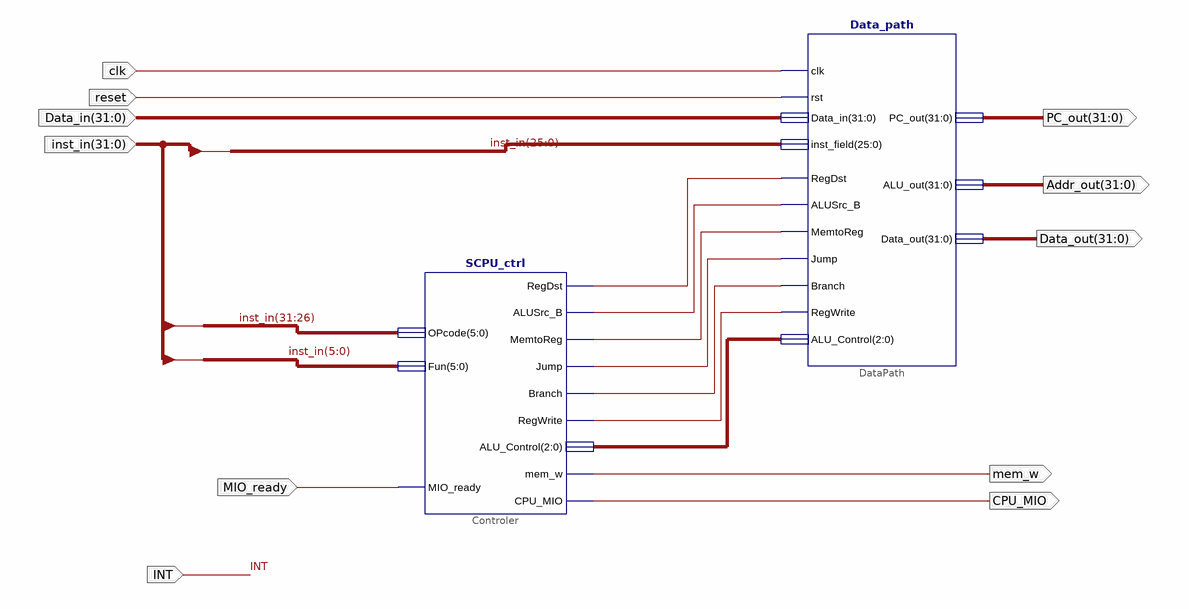
[diagram p0: schematic sheet 1]
// Xilinx ISE schematic SCPU.sch (kintex7) as structural Verilog: 2 symbols, 11 ports
module SCPU (
  input  clk,
  input  reset,
  input  [31:0] Data_in,
  input  [31:0] inst_in,
  input  MIO_ready,
  input  INT,
  output mem_w,
  output CPU_MIO,
  output [31:0] PC_out,
  output [31:0] Addr_out,
  output [31:0] Data_out
);

  wire XLXN_9, XLXN_10, XLXN_11, XLXN_12, XLXN_13, XLXN_14;
  wire [2:0] XLXN_15;

  Data_path DataPath (
    .RegDst(XLXN_9), .ALUSrc_B(XLXN_10), .MemtoReg(XLXN_11), .Jump(XLXN_12), .Branch(XLXN_13),
    .RegWrite(XLXN_14), .ALU_Control(XLXN_15), .Data_in(Data_in), .inst_field(inst_in[25:0]), .clk(clk),
    .rst(reset), .PC_out(PC_out), .ALU_out(Addr_out), .Data_out(Data_out));
  SCPU_ctrl Controler (
    .RegDst(XLXN_9), .ALUSrc_B(XLXN_10), .MemtoReg(XLXN_11), .Jump(XLXN_12), .Branch(XLXN_13),
    .RegWrite(XLXN_14), .ALU_Control(XLXN_15), .CPU_MIO(CPU_MIO), .mem_w(mem_w), .Fun(inst_in[5:0]),
    .MIO_ready(MIO_ready), .OPcode(inst_in[31:26]));
endmodule
